# EAGLE design IoT_Switch-V1 (EAGLE 9.6.1)
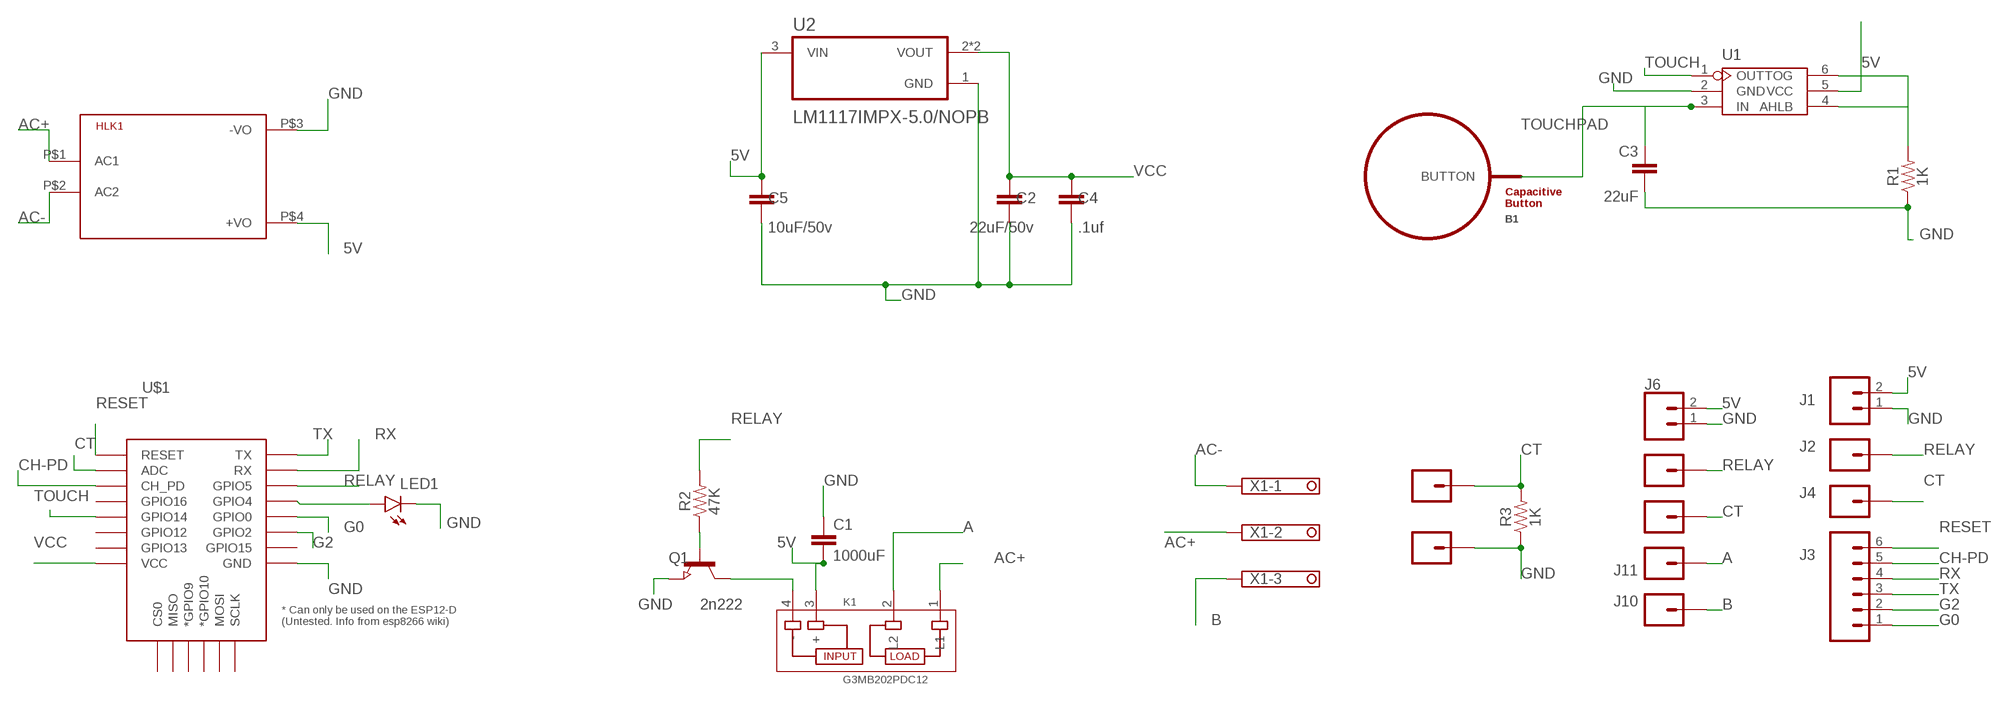
[diagram p0: schematic, sheet 1]

## Parts
B1  BUTTON_PASSIVE8MM  [BUTTON_PASSIVE_8MM]
C1  1000uF  1.0UF-0805-25V-10%  [0805]
C2  22uF/50v  22UF-0805-6.3V-20%  [0805]
C3  22uF  22UF-0805-6.3V-20%  [0805]
C4  .1uf  22UF-0805-6.3V-20%  [0805]
C5  10uF/50v  22UF-0805-6.3V-20%  [0805]
HLK1  HLK-PM013W  [HLK-PM01]
J1  CONN_02  [1X02]
J2  CONN_01  [1X01]
J3  CONN_06NO_SILK_FEMALE_PTH  [1X06_NO_SILK]
J4  CONN_01  [1X01]
J5  CONN_01  [1X01]
J6  CONN_02  [1X02]
J7  CONN_01  [1X01]
J8  CONN_01  [1X01]
J9  CONN_01  [1X01]
J10  CONN_01  [1X01]
J11  CONN_01  [1X01]
K1  G3MB202PDC12  [RELAY_G3MB202PDC12]
LED1  LED1206  [LED-1206]
Q1  2n222  NPN-TRANSISTOR_SOT23  [SOT23]
R1  1K  RESISTOR0805  [0805]
R2  47K  RESISTOR0805  [0805]
R3  1K  RESISTOR0805  [0805]
U1  TTP223  [SOT23-6L]
U2  LM1117IMPX-5.0/NOPB  [SOT230P700X180-4N]
U$1  ESP12ESMD  [ESP12E-SMD]
X1  TERMINAL-BLOCK-3.5MM-3-PIN-ROUND-PAD  [TERMINAL-BLOCK-3-PIN-3.5MM-ROUND-PAD]

## Nets
5V: C1.2 C5.1 HLK1.P$4(+VO) J1.2 J6.2 K1.3(+) U1.5(VCC) U2.3(VIN)
A: J11.1 K1.2(L2)
AC+: HLK1.P$1(AC1) K1.1(L1) X1.2
AC-: HLK1.P$2(AC2) X1.1
B: J10.1 X1.3
CH-PD: J3.5 U$1.CH_PD
CT: J4.1 J7.1 J8.1 R3.2 U$1.ADC
G0: J3.1 U$1.GPIO0
G2: J3.2 U$1.GPIO2
GND: C1.1 C2.2 C3.2 C4.2 C5.2 HLK1.P$3(-VO) J1.1 J6.1 J9.1 LED1.C Q1.2(E) R1.1 R3.1 U1.2(GND) U2.1(GND) U$1.GND
N$1: LED1.A U$1.GPIO4
N$4: K1.4(-) Q1.3(C)
N$5: Q1.1(B) R2.1
N$6: R1.2 U1.4(AHLB) U1.6(TOG)
RELAY: J2.1 J5.1 R2.2 U$1.GPIO5
RESET: J3.6 U$1.RESET
RX: J3.4 U$1.RXD0(RX)
TOUCH: U1.1(OUT) U$1.GPIO14
TOUCHPAD: B1.BUTTON C3.1 U1.3(IN)
TX: J3.3 U$1.TXD0(TX)
VCC: C2.1 C4.1 U2.2(VOUT) U2.4(VOUT) U$1.VCC
Unconnected: U$1.CS0 U$1.GPIO9(*GPIO9) U$1.GPIO10(*GPIO10) U$1.GPIO12 U$1.GPIO13 U$1.GPIO15 U$1.GPIO16 U$1.MISO U$1.MOSI U$1.SCLK

## Library data of the parts
B1 = PatternAgents-TouchWidgets:BUTTON_PASSIVE: Button, Passive Capacitive/Touch Sensing Type Source : http://www.PatternAgents.com Github : https://github.com/PatternAgents License : http://creativecommons.org/licenses/by-sa/3.1/ (Creative Commons 3.1) THIS SOFTWARE IS PROVIDED BY THE CONTRIBUTORS "AS IS" AND WITHOUT ANY EXPRESS OR IMPLIED WARRANTIES, INCLUDING, BUT NOT LIMITED TO, THE IMPLIED WARRANTIES OF MERCHANTABILITY AND FITNESS FOR A PARTICULAR PURPOSE ARE DISCLAIMED. IN NO EVENT SHALL THE COPYRIGHT OWNER OR CONTRIBUTORS BE LIABLE FOR ANY DIRECT, INDIRECT, INCIDENTAL, SPECIAL, EXEMPLARY, OR CONSEQUENTIAL DAMAGES (INCLUDING, BUT NOT LIMITED TO, PROCUREMENT OF SUBSTITUTE GOODS OR SERVICES; LOSS OF USE, DATA, OR PROFITS; OR BUSINESS INTERRUPTION) HOWEVER CAUSED AND ON ANY THEORY OF LIABILITY, WHETHER IN CONTRACT, STRICT LIABILITY, OR TORT (INCLUDING NEGLIGENCE OR OTHERWISE) ARISING IN ANY WAY OUT OF THE USE OF THIS SOFTWARE, EVEN IF ADVISED OF THE POSSIBILITY OF SUCH DAMAGE.
C1 = SparkFun-Capacitors:1.0UF: 1µF ceramic capacitors A capacitor is a passive two-terminal electrical component used to store electrical energy temporarily in an electric field.; PROD_ID: CAP-08064; VALUE: 1.0uF
C2 C4 C5 = SparkFun-Capacitors:22UF: 22µF ceramic capacitors A capacitor is a passive two-terminal electrical component used to store electrical energy temporarily in an electric field.; PROD_ID: CAP-08402; VALUE: 22uF
C3 = SparkFun-Capacitors:22UF: 22µF ceramic capacitors A capacitor is a passive two-terminal electrical component used to store electrical energy temporarily in an electric field.; PROD_ID: CAP-08402
HLK1 = HLK-PM01:HLK-PM01: Hi-Link Power Supply HLK-PM01 3W Author: Ahmed Said <https://github.com/AhmedSaid/EAGLELibraries>
J1 J6 = SparkFun-Connectors:CONN_02: Multi connection point. Often used as Generic Header-pin footprint for 0.1 inch spaced/style header connections On any of the 0.1 inch spaced packages, you can populate with these: Break Away Headers - Straight <https://www.sparkfun.com/products/116> (PRT-00116) Break Away Male Headers - Right Angle <https://www.sparkfun.com/products/553> (PRT-00553) Female Headers <https://www.sparkfun.com/products/115> (PRT-00115) Break Away Headers - Machine Pin <https://www.sparkfun.com/products/117> (PRT-00117) Break Away Female Headers - Swiss Machine Pin <https://www.sparkfun.com/products/743> (PRT-00743) For SCREWTERMINALS and SPRING TERMINALS visit here: Screw Terimnals on SparkFun.com <https://www.sparkfun.com/search/results?term=Screw+Terminals> (5mm/3.5mm/2.54mm spacing) This device is also useful as a general connection point to wire up your design to another part of your project. Our various solder wires solder well into these plated through hole pads. Hook-Up Wire - Assortment (Stranded, 22 AWG) <https://www.sparkfun.com/products/11375> (PRT-11375) Hook-Up Wire - Assortment (Solid Core, 22 AWG) <https://www.sparkfun.com/products/11367> (PRT-11367) View the entire wire category on our website here <https://www.sparkfun.com/categories/141> Special notes: Molex polarized connector foot print use with: PRT-08233 with associated crimp pins and housings. 2.54_SCREWTERM for use with PRT-10571. 3.5mm Screw Terminal footprints for PRT-08084 5mm Screw Terminal footprints for use with PRT-08432
J2 J4 J5 J7-J11 = SparkFun-Connectors:CONN_01: Single connection point. Often used as Generic Header-pin footprint for 0.1 inch spaced/style header connections On any of the 0.1 inch spaced packages, you can populate with these: Break Away Headers - Straight <https://www.sparkfun.com/products/116> (PRT-00116) Break Away Male Headers - Right Angle <https://www.sparkfun.com/products/553> (PRT-00553) Female Headers <https://www.sparkfun.com/products/115> (PRT-00115) Break Away Headers - Machine Pin <https://www.sparkfun.com/products/117> (PRT-00117) Break Away Female Headers - Swiss Machine Pin <https://www.sparkfun.com/products/743> (PRT-00743) This device is also useful as a general connection point to wire up your design to another part of your project. Our various solder wires solder well into these plated through hole pads. Hook-Up Wire - Assortment (Stranded, 22 AWG) <https://www.sparkfun.com/products/11375> (PRT-11375) Hook-Up Wire - Assortment (Solid Core, 22 AWG) <https://www.sparkfun.com/products/11367> (PRT-11367) View the entire wire category on our website here <https://www.sparkfun.com/categories/141> Special notes: SMTSO-256-ET is a "flush mount" nut for a 4-40 screw. We mostly use this on specialty testbeds; it is a nice way to connect hardware to your PCB at an adjustable hieght. Also note, the SNAP packages are for using a snappable style connector. We sell a baggie of snaps and they are also used on two LilyPad designs: Snap Assortment - 30 pack (male and female) <https://www.sparkfun.com/products/11347> (DEV-11347) LilyPad Arduino SimpleSnap <https://www.sparkfun.com/products/10941> (DEV-10941) LilyPad SimpleSnap Protoboard <https://www.sparkfun.com/products/10940> (DEV-10940)
J3 = SparkFun-Connectors:CONN_06: Multi connection point. Often used as Generic Header-pin footprint for 0.1 inch spaced/style header connections On any of the 0.1 inch spaced packages, you can populate with these: Break Away Headers - Straight <https://www.sparkfun.com/products/116> (PRT-00116) Break Away Male Headers - Right Angle <https://www.sparkfun.com/products/553> (PRT-00553) Female Headers <https://www.sparkfun.com/products/115> (PRT-00115) Break Away Headers - Machine Pin <https://www.sparkfun.com/products/117> (PRT-00117) Break Away Female Headers - Swiss Machine Pin <https://www.sparkfun.com/products/743> (PRT-00743) Arduino Stackable Header - 6 Pin <https://www.sparkfun.com/products/9280> (PRT-09280) For SCREWTERMINALS and SPRING TERMINALS visit here: Screw Terimnals on SparkFun.com <https://www.sparkfun.com/search/results?term=Screw+Terminals> (5mm/3.5mm/2.54mm spacing) This device is also useful as a general connection point to wire up your design to another part of your project. Our various solder wires solder well into these plated through hole pads. Hook-Up Wire - Assortment (Stranded, 22 AWG) <https://www.sparkfun.com/products/11375> (PRT-11375) Hook-Up Wire - Assortment (Solid Core, 22 AWG) <https://www.sparkfun.com/products/11367> (PRT-11367) View the entire wire category on our website here <https://www.sparkfun.com/categories/141>; PROD_ID: CONN-08437
K1 = G3MB202PDC12:G3MB202PDC12: Relay 12vdc Isolation Photot; AVAILABILITY: Unavailable; DESCRIPTION: Relay • Solid-State • Phototriac • Base: PCB terminal • Amperage: 2 AMP • Coil Voltage: 24 Vdc • Configuration: SPST-...; MF: Omron Automation; MP: G3MB-202P-DC12; PACKAGE: SIP-4 Omron; PRICE: None
LED1 = SparkFun-LED:LED: LED (Generic) Standard schematic elements and footprints for 5mm, 3mm, 1206, and 0603 sized LEDs. Generic LEDs with no color specified.
Q1 = semicon-smd-ipc:NPN-TRANSISTOR_: NPN TRANSISTOR
R1-R3 = SparkFun-Resistors:RESISTOR: Generic Resistor Package
U1 = TTP223:TTP223: vowa-antilamer@ya.ru; AVAILABILITY: Unavailable; MF: TONTEK; MP: TTP223; PACKAGE: Package Analog Devices; PRICE: None
U2 = LM1117IMPX-5.0_NOPB:LM1117IMPX-5.0/NOPB: Buy Part <https://snapeda.com/parts/LM1117IMPX-5.0/Texas%20Instruments/view-part/?ref=eda>; AVAILABILITY: Warning; DESCRIPTION: Linear Voltage Regulator IC 1 Output 800mA SOT-223-4; DIGIKEY-PURCHASE-URL: https://snapeda.com/shop?store=DigiKey&id=4712659; MF: Texas Instruments; MP: LM1117IMPX-5.0; PACKAGE: SOT-223-4 Texas Instruments; PRICE: None
U$1 = esp8266modules:ESP12E: ESP12E Module
X1 = Rembrandt Electronics - Terminal Block 3-5mm v1-0:TERMINAL-BLOCK-3.5MM-3-PIN: Terminal Block 3.5mm Pitch: 3,5 mm Number of pins: 3 Created by Rembrandt Electronics www.rembrandtelectronics.com

## Board
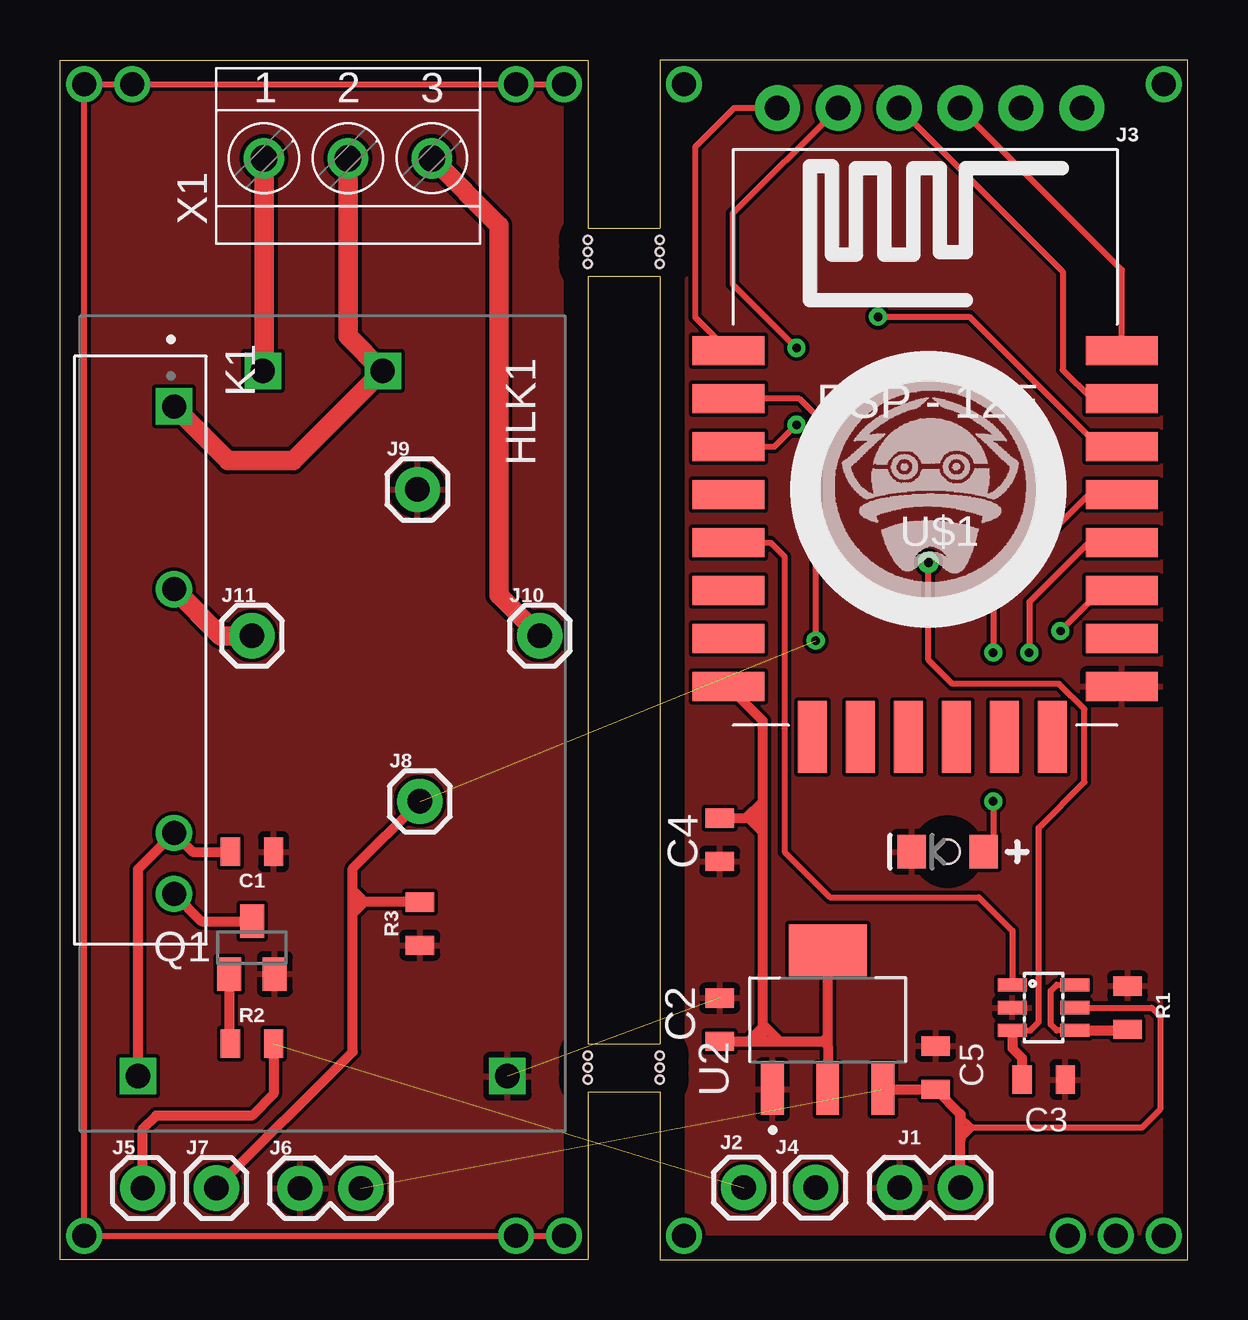
[diagram p1: board, top side]
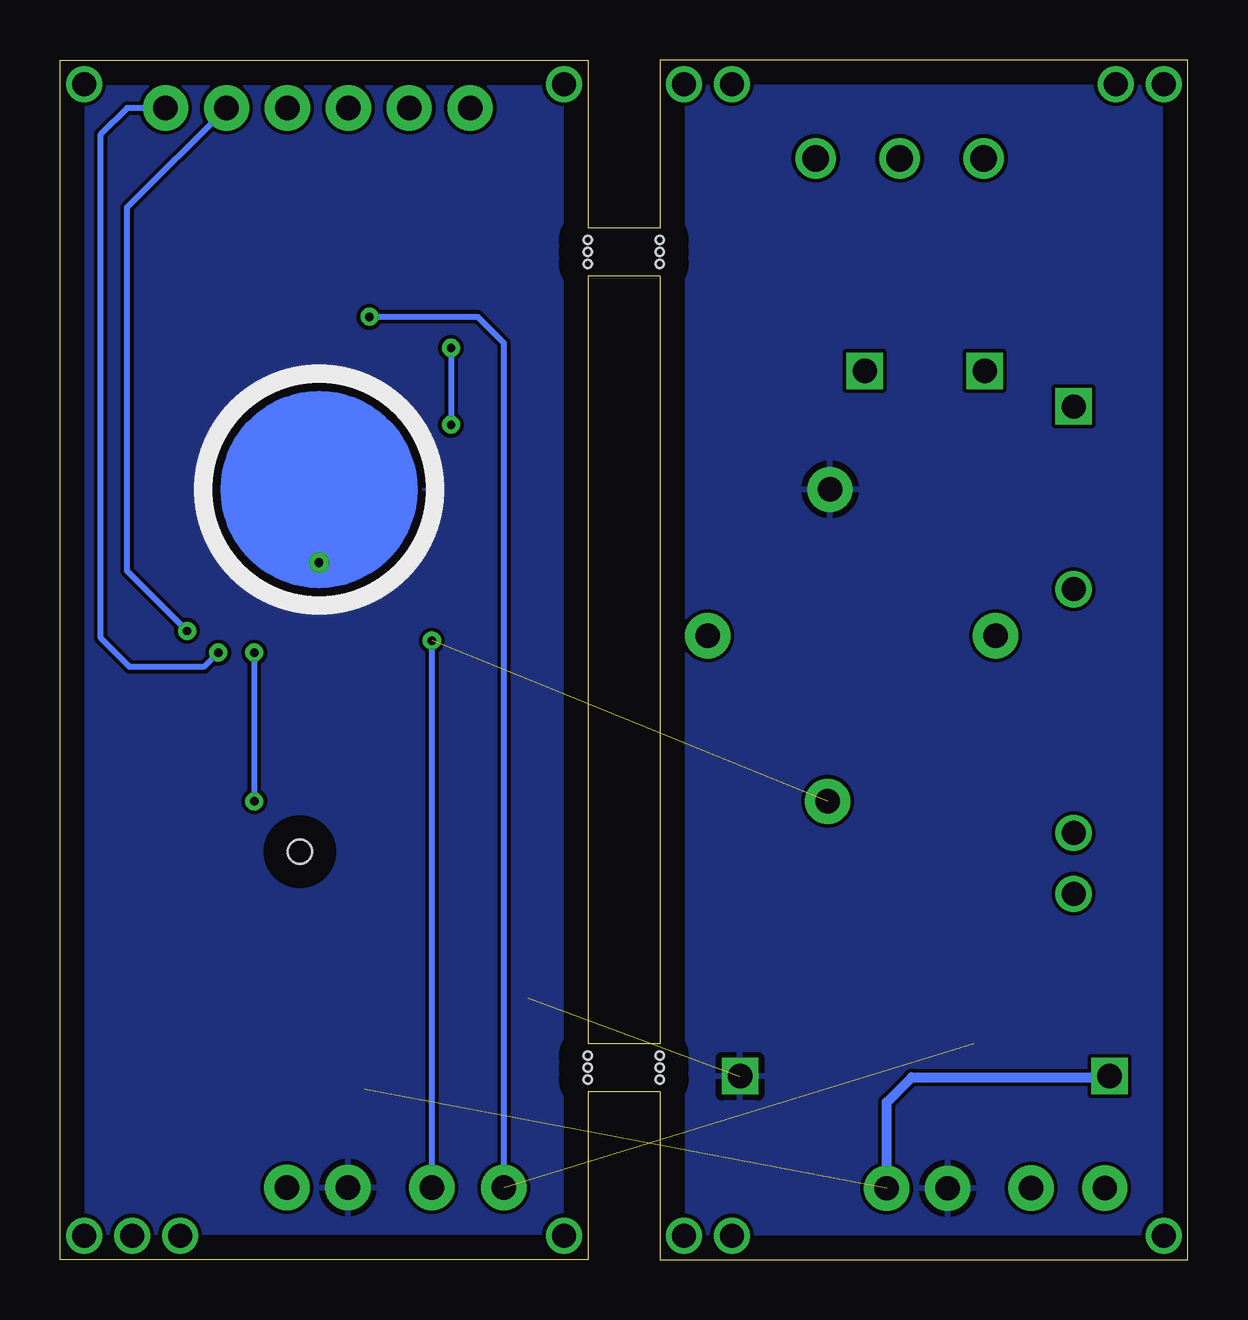
[diagram p2: board, bottom side, seen from below]

Size 47 x 50 mm. Coordinates in mm from the lower left corner, seen from the top.
Outline: 25,0 47,0 47,50 25,50 25,43 22,43 22,50 0,50 0,0 22,0 22,7 25,7 25,0
Outline: 25,41 25,9 22,9 22,41 25,41
Copper layers (1*16): Top 0.035mm / dielectric 1.5mm / Bottom 0.035mm
Design rules "default": minimum track width 6mil, minimum drill 0.35mm, track to track 6mil, track to pad 6mil, pad to pad 6mil, via to via 6mil, smd to smd 6mil, copper to edge 40mil, drill to drill 6mil, minimum pad ring 10mil, minimum via ring 8mil, stop-mask expansion 4mil, vias tented up to drill 0mil, thermal gap 10mil
Holes 0.35 mm at 22,42 25,42 22,42.5 22,41.5 25,42.5 25,41.5 22,8.5 22,8 22,7.5 25,8.5 25,8 25,7.5
Holes 1 mm at 37,17

### Footprints (pad centres in the part's own frame; a part is rotated, then mirrored left to right if it is on the bottom)
BUTTON_PASSIVE_8MM = drill 0.356: BUTTON 0,3.048
0805 = smd 0.8 x 1.2: 1 -0.9,0; 2 0.9,0
HLK-PM01 = drill 1.016 square: P$1 -14.7,2.5; P$2 -14.7,-2.5; P$3 14.7,7.7; P$4 14.7,-7.7
1X02 = drill 1.016 pad 1.88: 1 0,0; 2 2.54,0
1X01 = drill 1.016 pad 1.88: 1 0,0
1X06_NO_SILK = drill 1.016 pad 1.88: 1 0,0; 2 2.54,0; 3 5.08,0; 4 7.62,0; 5 10.16,0; 6 12.7,0
RELAY_G3MB202PDC12 = drill 1 square: 1 -10.16,1.4 | drill 1: 2 -2.54,1.4; 3 7.62,1.4; 4 10.16,1.4
LED-1206 = smd 1.2 x 1.4: A -1.5,0; C 1.5,0
SOT23 = smd 1 x 1.4: 1 -0.95,-1.1; 2 0.95,-1.1; 3 0,1.1
SOT23-6L = smd 0.55 x 1.2: 1 -0.95,-1.3; 2 0,-1.3; 3 0.95,-1.3; 4 0.95,1.3; 5 0,1.3; 6 -0.95,1.3
SOT230P700X180-4N = smd 2.15 x 0.95: 1 -2.9,2.3; 2 -2.9,0; 3 -2.9,-2.3 | smd 2.15 x 3.25: 4 2.9,0
ESP12E-SMD = smd 3 x 1.2: ADC -8.3,3.8; CH_PD -8.3,1.8; GND 8.1,-8.2; GPIO0 8.1,-2.2; GPIO2 8.1,-4.2; GPIO4 8.1,-0.2; GPIO5 8.1,1.8; GPIO12 -8.3,-4.2; GPIO13 -8.3,-6.2; GPIO14 -8.3,-2.2; GPIO15 8.1,-6.2; GPIO16 -8.3,-0.2; RESET -8.3,5.8; RXD0 8.1,3.8; TXD0 8.1,5.8; VCC -8.3,-8.2 | smd 1.2 x 3: CS0 -4.8,-10.3; GPIO9 -0.8,-10.3; GPIO10 1.2,-10.3; MISO -2.8,-10.3; MOSI 3.2,-10.3; SCLK 5.2,-10.3
TERMINAL-BLOCK-3-PIN-3.5MM-ROUND-PAD = drill 1.1 pad 1.7: 1 -3.5,-0.1; 2 0,-0.1; 3 3.5,-0.1

### Placement (x,y rotation side)
B1  36.2,32.1 180 bottom
C1  8,17 180 top
C2  27.5,10 90 top
C3  41,7.5 0 top
C4  27.5,17.5 270 top
C5  36.5,8 90 top
HLK1  10.95,22.34 270 top
J1  35,3 0 top
J2  28.5,3 90 top
J3  42.6,48 180 top
J4  31.5,3 0 top
J5  3.45,2.98 0 top
J6  10,2.97 0 top
J7  6.52,2.98 0 top
J8  15,19.1 0 top
J9  14.9,32.1 0 top
J10  20,26 0 top
J11  8,26 0 top
K1  3.35,25.4 270 top
LED1  37,17 180 top
Q1  8,13 0 top
R1  44.5,10.5 270 top
R2  8,9 0 top
R3  15,14 90 top
U1  41,10.5 270 top
U2  32,10 90 top
U$1  36.17,32.08 0 top
X1  12,46 0 top

### Tracks (layer width: path | path; a pad name or v marks a point on that pad's centre or on a via)
5V  (1 unrouted)
  Top 0.254: U1.5 45.5,10.5 45.86,10.14 45.86,6.26 45.1,5.5 38,5.5 | 37.54,5.5 38,5.5 | 38,5.5 38,5.54 37.54,6 | 38,5.5 38,5.46 37.54,5
  Top 0.406: C1.2 5.53,17 K1.3 3.25,16.28 HLK1.P$4 | 36.3,6.9 C5.1 | J1.2 37.54,5 37.54,5.5 37.54,6 37.54,6.06 C5.1 | U2.3 C5.1
  Bottom 0.406: J6.2 12.54,6.56 11.5,7.6 3.29,7.6 HLK1.P$4
A
  Top 0.813: J11.1 6.69,26 K1.2
AC+
  Top 0.813: X1.2 12,38.49 HLK1.P$1 9.71,33.3 7.01,33.3 K1.1
AC-
  Top 0.813: X1.1 8.5,37.09 HLK1.P$2
B
  Top 0.813: J10.1 18.3,27.7 18.3,43.1 X1.3
CH-PD  (via drill 0.35)
  Top 0.254: U$1.CH_PD 29.78,33.88 v30.7,34.8 | J3.5 28.04,43.6 28.04,40.66 v30.7,38
  Bottom 0.254: v30.7,38 v30.7,34.8
CT  (via drill 0.35)  (1 unrouted)
  Top 0.254: U$1.ADC 30.82,35.88 31.5,35.2 v31.5,25.8
  Top 0.406: J7.1 12.2,8.66 12.2,14.4 | J8.1 12.2,16.3 12.2,15.4 | 12.2,14.4 12.2,14.8 | 12.2,14.8 12.2,15.4 | R3.2 12.7,14.9 | 12.7,14.9 12.3,14.9 12.2,14.8 | 12.2,15.4 12.7,14.9 | 12.2,14.4 12.7,14.9
  Bottom 0.254: J4.1 v31.5,25.8
G0  (via drill 0.35)
  Top 0.254: U$1.GPIO0 42.88,29.88 40.4,27.4 v40.4,25.3
  Bottom 0.254: v40.4,25.3 41,24.7 44.1,24.7 45.3,25.9 45.3,46.9 44.2,48 J3.1
G2  (via drill 0.35)
  Top 0.254: U$1.GPIO2 43.34,27.84 v41.7,26.2
  Bottom 0.254: v41.7,26.2 44.2,28.7 44.2,43.86 J3.2
GND  (1 unrouted)
  Top 0.152: 27.9,11.22 C2.2
  pour Top: -1,-1 -1,51 11,51 48,51 48,49 48,-1
  pour Bottom: -2,-2 -2,52 6,52 49,52 49,48 49,-2
N$1  (via drill 0.35)
  Top 0.254: U$1.GPIO4 42.88,31.88 38.9,27.9 v38.9,25.3 | v38.9,19.1 38.9,17.4 38.64,17.14 38.64,17 | 38.7,16.94 38.74,16.9 38.6,16.9 LED1.A | 38.64,17 38.7,16.94 | 38.7,16.94 38.7,16.8 38.64,16.86 38.64,17
  Bottom 0.254: v38.9,25.3 v38.9,19.1
N$2  (via drill 1)
  other vias: 26,49
N$3  (via drill 1)
  other vias: 46,49
N$4
  Top 0.406: K1.4 5.89,14.1 Q1.3
N$5
  Top 0.406: Q1.1 7.05,9.05 R2.1
N$6
  Top 0.254: U1.4 41.55,9.55 41.3,9.8 41.3,11.2 41.55,11.45 U1.6
  Top 0.406: U1.4 44.45,9.55 R1.2
N$7  (via drill 1)
  Top 0.254: v21,1 v19,1 v1,1 v1,49 v3,49 v19,49 v21,49
N$9  (via drill 1)
  other vias: 26,1
N$13  (via drill 1)
  other vias: 46,1
N$14  (via drill 1)
  other vias: 44,1
N$15  (via drill 1)
  other vias: 42,1
RELAY  (via drill 0.35)  (1 unrouted)
  Top 0.254: v34.1,39.3 37.9,39.3 43.32,33.88 U$1.GPIO5
  Top 0.406: J5.1 3.45,5.45 4,6 8,6 8.9,6.9 R2.2
  Bottom 0.254: v34.1,39.3 29.6,39.3 28.5,38.2 J2.1
RESET
  Top 0.254: J3.6 28.1,48 26.47,46.37 26.47,39.28 U$1.RESET
RX
  Top 0.254: U$1.RXD0 43,35.88 41.8,37.08 41.8,41.18 J3.4
TOUCH
  Top 0.254: U$1.GPIO14 29.62,29.88 30.2,29.3 30.2,17 32.1,15.1 38.3,15.1 39.7,13.7 U1.1
TOUCHPAD
  Top 0.254: B1.BUTTON 36.2,25 37.2,24 41.65,24 42.7,22.95 42.7,19.9 40.8,18 40.8,9.9 40.45,9.55 U1.3
  Top 0.406: U1.3 39.7,8.8 40.1,8.4 C3.1
TX
  Top 0.254: U$1.TXD0 44.27,41.25 J3.3
VCC
  Top 0.406: C2.1 28.7,9.1 | 28.7,9.1 29.3,9.1 | 29.3,9.1 30,9.1 | 30,9.1 31.8,9.1 | 29.3,9.1 29.3,9.7 | 29.3,9.8 29.3,17.8 | 29.3,17.8 29.3,18.4 | 29.3,18.4 29.3,19.1 | 29.3,19.1 29.3,22.45 U$1.VCC | C4.1 28.6,18.4 | 28.7,18.4 29.3,18.4 | 28.6,18.4 29.3,19.1 | 28.6,18.4 28.7,18.4 | 28.7,18.4 29.3,17.8 | 28.7,9.1 29.3,9.7 | 29.3,9.7 29.3,9.8 | 29.3,9.8 30,9.1 | 31.8,12.7 U2.4 32,9.3 | U2.2 32,8 32,8.9 | 32,8.9 32,9.3 | 31.8,9.1 32,9.3 | 31.8,9.1 32,8.9